# EAGLE design pc_kalam_v3 (EAGLE 6.4)
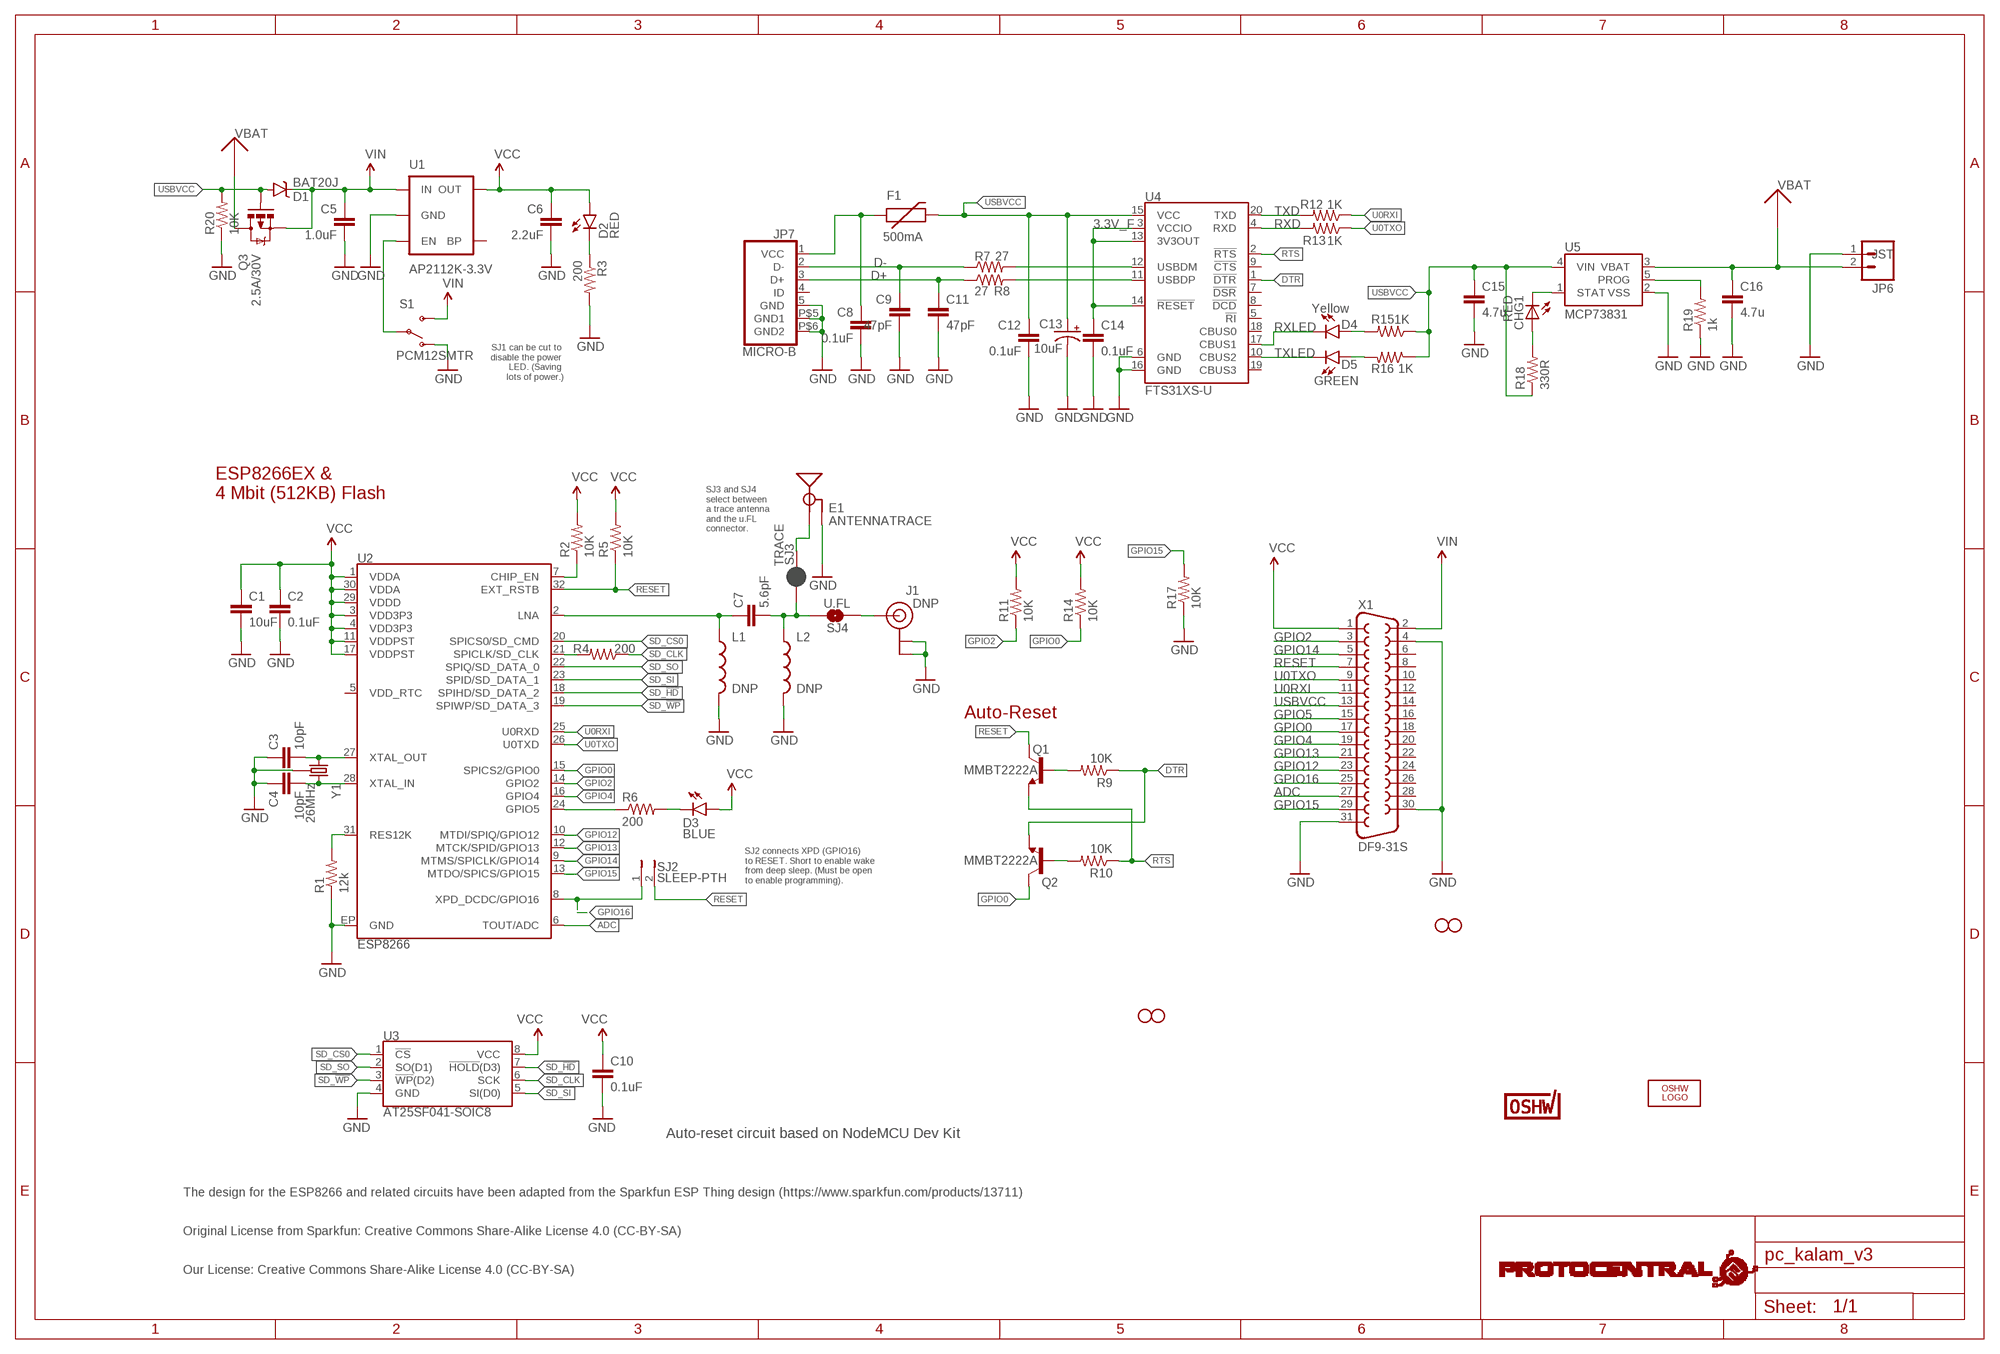
[diagram p0: schematic, sheet 1]

## Parts
C1  10uF  10UF-6.3V-20%(0603)  [0603-CAP]
C2  0.1uF  0.1UF-25V(+80/-20%)(0603)  [0603-CAP]
C3  10pF  10PF-50V-5%(0603)  [0603-CAP]
C4  10pF  10PF-50V-5%(0603)  [0603-CAP]
C5  1.0uF  1.0UF-25V-+80/-20(0805)  [0805]
C6  2.2uF  2.2UF-10V-20%(0603)  [0603-CAP]
C7  5.6pF  CAP0603-CAP  [0603-CAP]
C8  0.1uF  C-EUC0402  [C0402]
C9  47pF  47PF-50V-5%(0603)  [0603-CAP]
C10  0.1uF  0.1UF-25V(+80/-20%)(0603)  [0603-CAP]
C11  47pF  47PF-50V-5%(0603)  [0603-CAP]
C12  0.1uF  0.1UF-25V(+80/-20%)(0603)  [0603-CAP]
C13  10uF  10UF-16V-10%(TANT)  [EIA3216]
C14  0.1uF  0.1UF-25V(+80/-20%)(0603)  [0603-CAP]
C15  4.7u  C-EUC0805  [C0805]
C16  4.7u  C-EUC0805  [C0805]
CHG1  RED  LEDCHIPLED_0603  [CHIPLED_0603]
D1  BAT20J  DIODE-SCHOTTKY-BAT20J  [SOD-323]
D2  RED  LED-RED0603  [LED-0603]
D3  BLUE  LED-BLUE0603  [LED-0603]
D4  Yellow  LED-YELLOW0603  [LED-0603]
D5  GREEN  LED-GREEN0603  [LED-0603]
E1  ANTENNATRACE  [TRACE_ANTENNA_2.4GHZ_25.7MM]
F1  500mA  PTCSMD  [PTC-1206]
J1  DNP  U.FL  [U.FL]
JP6  M02-JST-2MM-SMT  [JST-2-SMD]
JP7  MICRO-B  [MICRO-B]
L1  DNP  INDUCTOR0603  [0603]
L2  DNP  INDUCTOR0603  [0603]
LOGO2  OSHW_LOGO_FILLX0200-NT  [OSHW_FILLX200_NOTEXT]
Q1  MMBT2222A  TRANSISTOR_NPNMMBT2222A  [SOT23-3@1]
Q2  MMBT2222A  TRANSISTOR_NPNMMBT2222A  [SOT23-3@1]
Q3  2.5A/30V  MOSFET-PCHANNELDMG2307L  [SOT23-3]
R1  12k  12KOHM-1/10W-1%(0603)  [0603-RES]
R2  10K  10KOHM1/10W1%(0603)0603  [0603-RES]
R3  200  200OHM1/10W1%(0603)  [0603-RES]
R4  200  200OHM1/10W1%(0603)  [0603-RES]
R5  10K  10KOHM1/10W1%(0603)0603  [0603-RES]
R6  200  200OHM1/10W1%(0603)  [0603-RES]
R7  27  27OHM1/10W1%(0603)0603-RES  [0603-RES]
R8  27  27OHM1/10W1%(0603)0603-RES  [0603-RES]
R9  10K  10KOHM1/10W1%(0603)0603  [0603-RES]
R10  10K  10KOHM1/10W1%(0603)0603  [0603-RES]
R11  10K  10KOHM1/10W1%(0603)0603  [0603-RES]
R12  1K  1KOHM-1/10W-1%(0603)  [0603-RES]
R13  1K  1KOHM-1/10W-1%(0603)  [0603-RES]
R14  10K  10KOHM1/10W1%(0603)0603  [0603-RES]
R15  1K  1KOHM-1/10W-1%(0603)  [0603-RES]
R16  1K  1KOHM-1/10W-1%(0603)  [0603-RES]
R17  10K  10KOHM1/10W1%(0603)0603  [0603-RES]
R18  330R  R-US_R0402  [R0402]
R19  1k  R-US_R0402  [R0402]
R20  10K  R-US_R0402  [R0402]
S1  PCM12SMTR  SWITCH-SPDT-SMD-A  [SWITCH-SPST-SMD-A]
SJ2  SLEEP-PTH  JUMPER-PTH-2-NO  [PTH-JUMPER-2-NO_NO_SILK]
SJ3  TRACE  JUMPER-PAD-2-NC_BY_PASTENO-SILK  [PAD-JUMPER-2-NC_BY_PASTE_NO_SILK]
SJ4  U.FL  JUMPER-PAD-2-NO  [PAD-JUMPER-2-NO_NO_SILK]
STANDOFF1  STAND-OFF  [STAND-OFF]
STANDOFF2  STAND-OFF  [STAND-OFF]
STANDOFF3  STAND-OFF  [STAND-OFF]
STANDOFF4  STAND-OFF  [STAND-OFF]
U1  AP2112K-3.3V  V_REG_LDOSMD  [SOT23-5]
U2  ESP8266  [QFN32]
U3  AT25SF041-SOIC8  [SO08]
U4  FTS31XS-U  FT231XS  [SSOP20_L]
U5  MCP73831  [SOT23-5]
U$1  PROTY_LOGO_WITH_TEXT  [PROTY_WITH_TEXT]
U$5  CERT-MEDIUM  [CERT-MED-SILK]
U$8  PROTY-LOGO  [LOGO-PROTY]
X1  DF9-31S  [DF9-31S]
Y1  26MHz  CRYSTAL-GROUNDED3.2X2.5  [CRYSTAL-SMD-3.2X2.5]

## Nets
3.3V_F: C14.1 U4.3(VCCIO) U4.13(3V3OUT) U4.14(!RESET)
ADC: U2.6(TOUT/ADC) X1.27
ANT: J1.P$3(SIGNAL) SJ4.1
CHIP_EN: R2.1 U2.7(CHIP_EN)
D+: C11.1 JP7.3(D+) R8.1
D-: C9.1 JP7.2(D-) R7.1
DTR: Q2.2(E) R9.1 U4.1(!DTR)
GND: C1.2 C2.2 C3.1 C4.1 C5.2 C6.2 C8.2 C9.2 C10.2 C11.2 C12.2 C13.C(-) C14.2 C15.2 C16.2 E1.GND E1.GND2(GND) J1.P$1(GND) J1.P$2(GND) JP6.1 JP7.5(GND) JP7.P$5(GND1) JP7.P$6(GND2) L1.2 L2.2 R1.1 R3.2 R17.1 R19.1 R20.1 S1.1(O) U1.2(GND) U2.EP(GND) U3.4(GND) U4.6(GND) U4.16(GND) U5.2(VSS) X1.4 X1.30 X1.31 Y1.2(GND) Y1.4(GND)
GPIO0: Q2.3(C) R14.1 U2.15(SPICS2/GPIO0) X1.17
GPIO2: R11.1 U2.14(GPIO2) X1.3
GPIO4: U2.16(GPIO4) X1.19
GPIO5: R6.1 U2.24(GPIO5) X1.15
GPIO12: U2.10(MTDI/SPIQ/GPIO12) X1.23
GPIO13: U2.12(MTCK/SPID/GPIO13) X1.21
GPIO14: U2.9(MTMS/SPICLK/GPIO14) X1.5
GPIO15: R17.2 U2.13(MTDO/SPICS/GPIO15) X1.29
GPIO16: SJ2.1 U2.8(XPD_DCDC/GPIO16) X1.25
LNA: C7.1 L1.1 U2.2(LNA)
LNA2: C7.2 L2.1 SJ3.1 SJ4.2
N$1: R1.2 U2.31(RES12K)
N$2: C4.2 U2.28(XTAL_IN) Y1.3
N$3: C3.2 U2.27(XTAL_OUT) Y1.1
N$4: R7.2 U4.12(USBDM)
N$6: Q1.1(B) R9.2
N$7: R8.2 U4.11(USBDP)
N$8: D5.A R16.2
N$9: D3.C R6.2
N$10: D4.A R15.2
N$11: D2.C R3.1
N$12: Q2.1(B) R10.2
N$13: CHG1.C U5.1(STAT)
N$14: S1.2(P) U1.3(EN)
N$15: CHG1.A R18.2
N$19: R19.2 U5.5(PROG)
RESET: Q1.3(C) R5.1 SJ2.2 U2.32(EXT_RSTB) X1.7
RTS: Q1.2(E) R10.1 U4.2(!RTS)
RXD: R13.2 U4.4(RXD)
RXLED: D4.C U4.17(CBUS1)
SD_!HD!: U2.18(SPIHD/SD_DATA_2) U3.7(!HOLD!(D3))
SD_!WP!: U2.19(SPIWP/SD_DATA_3) U3.3(!WP!(D2))
SD_CLK: R4.1 U3.6(SCK)
SD_CLK0: R4.2 U2.21(SPICLK/SD_CLK)
SD_CS0: U2.20(SPICS0/SD_CMD) U3.1(!CS!)
SD_SI: U2.23(SPID/SD_DATA_1) U3.5(SI(D0))
SD_SO: U2.22(SPIQ/SD_DATA_0) U3.2(SO(D1))
TRACE_ANT: E1.ANT(SIGNAL) SJ3.2
TXD: R12.2 U4.20(TXD)
TXLED: D5.C U4.10(CBUS2)
U0RXI: R12.1 U2.25(U0RXD) X1.11
U0TXO: R13.1 U2.26(U0TXD) X1.9
USBVCC: C12.1 C13.A(+) C15.1 D1.A F1.2 Q3.1(G) R15.1 R16.1 R18.1 R20.2 U4.15(VCC) U5.4(VIN) X1.13
VBAT: C16.1 JP6.2 Q3.3(D) U5.3(VBAT)
VCC: C1.1 C2.1 C6.1 C10.1 D2.A D3.A R2.2 R5.2 R11.2 R14.2 U1.5(OUT) U2.1(VDDA) U2.3(VDD3P3) U2.4(VDD3P3) U2.11(VDDPST) U2.17(VDDPST) U2.29(VDDD) U2.30(VDDA) U3.8(VCC) X1.1
VIN: C5.1 D1.C Q3.2(S) S1.3(S) U1.1(IN) X1.2
VUSB: C8.1 F1.1 JP7.1(VCC)
Unconnected: JP7.4(ID) U1.4(BP) U2.5(VDD_RTC) U4.5(!RI) U4.7(!DSR) U4.8(!DCD) U4.9(!CTS) U4.18(CBUS0) U4.19(CBUS3) X1.6 X1.8 X1.10 X1.12 X1.14 X1.16 X1.18 X1.20 X1.22 X1.24 X1.26 X1.28

## Notes on the sheet
- JST
- SJ1 can be cut to 
  disable the power 
  LED. (Saving 
  lots of power.)
- SJ3 and SJ4
  select between
  a trace antenna
  and the u.FL 
  connector.
- ESP8266EX &
  4 Mbit (512KB) Flash
- DNP
- Auto-Reset
- SJ2 connects XPD (GPIO16) 
  to RESET. Short to enable wake 
  from deep sleep. (Must be open
  to enable programming).
- Auto-reset circuit based on NodeMCU Dev Kit
- The design for the ESP8266 and related circuits have been adapted from the Sparkfun ESP Thing design (https://www.sparkfun.com/products/13711)
- Original License from Sparkfun: Creative Commons Share-Alike License 4.0 (CC-BY-SA)
- Our License: Creative Commons Share-Alike License 4.0 (CC-BY-SA)

## Library data of the parts
C1 = SparkFun-Capacitors:10UF-6.3V-20%(0603): CAP-11015; PROD_ID: CAP-11015
C2 C10 C12 C14 = SparkFun-Capacitors:0.1UF-25V(+80/-20%)(0603): CAP-00810 Ceramic Standard decoupling cap; PROD_ID: CAP-00810
C3 C4 = SparkFun-Capacitors:10PF-50V-5%(0603): CAP-11812; PROD_ID: CAP-11812
C5 = SparkFun-Capacitors:1.0UF-25V-+80/-20(0805): CAP-11625; PROD_ID: CAP-11625
C6 = SparkFun-Capacitors:2.2UF-10V-20%(0603): CAP-07888; PROD_ID: CAP-07888
C7 = SparkFun-Capacitors:CAP: Capacitor Standard 0603 ceramic capacitor, and 0.1" leaded capacitor.; PROD_ID: CAP-12456
C8 C15 C16 = rcl:C-EU: CAPACITOR, European symbol
C9 C11 = SparkFun-Capacitors:47PF-50V-5%(0603): CAP-08913; PROD_ID: CAP-08913
C13 = SparkFun-Capacitors:10UF-16V-10%(TANT): CAP-00811 1206/EIA-3216 Tantalum capacitor; PROD_ID: CAP-00811
CHG1 = led:LED: LED OSRAM: - CHIPLED LG R971, LG N971, LY N971, LG Q971, LY Q971, LO R971, LY R971 LH N974, LH R974 LS Q976, LO Q976, LY Q976 LO Q996 - Hyper CHIPLED LW Q18S LB Q993, LB Q99A, LB R99A - SideLED LS A670, LO A670, LY A670, LG A670, LP A670 LB A673, LV A673, LT A673, LW A673 LH A674 LY A675 LS A676, LA A676, LO A676, LY A676, LW A676 LS A679, LY A679, LG A679 - Hyper Micro SIDELED® LS Y876, LA Y876, LO Y876, LY Y876 LT Y87S - SmartLED LW L88C, LW L88S LB L89C, LB L89S, LG L890 LS L89K, LO L89K, LY L89K LS L896, LA L896, LO L896, LY L896 - TOPLED LS T670, LO T670, LY T670, LG T670, LP T670 LSG T670, LSP T670, LSY T670, LOP T670, LYG T670 LG T671, LOG T671, LSG T671 LB T673, LV T673, LT T673, LW T673 LH T674 LS T676, LA T676, LO T676, LY T676, LB T676, LH T676, LSB T676, LW T676 LB T67C, LV T67C, LT T67C, LS T67K, LO T67K, LY T67K, LW E67C LS E67B, LA E67B, LO E67B, LY E67B, LB E67C, LV E67C, LT E67C LW T67C LS T679, LY T679, LG T679 LS T770, LO T770, LY T770, LG T770, LP T770 LB T773, LV T773, LT T773, LW T773 LH T774 LS E675, LA E675, LY E675, LS T675 LS T776, LA T776, LO T776, LY T776, LB T776 LHGB T686 LT T68C, LB T68C - Hyper Mini TOPLED® LB M676 - Mini TOPLED Santana® LG M470 LS M47K, LO M47K, LY M47K Source: http://www.osram.convergy.de LUXEON: - LUMILED® LXK2-PW12-R00, LXK2-PW12-S00, LXK2-PW14-U00, LXK2-PW14-V00 LXK2-PM12-R00, LXK2-PM12-S00, LXK2-PM14-U00 LXK2-PE12-Q00, LXK2-PE12-R00, LXK2-PE12-S00, LXK2-PE14-T00, LXK2-PE14-U00 LXK2-PB12-K00, LXK2-PB12-L00, LXK2-PB12-M00, LXK2-PB14-N00, LXK2-PB14-P00, LXK2-PB14-Q00 LXK2-PR12-L00, LXK2-PR12-M00, LXK2-PR14-Q00, LXK2-PR14-R00 LXK2-PD12-Q00, LXK2-PD12-R00, LXK2-PD12-S00 LXK2-PH12-R00, LXK2-PH12-S00 LXK2-PL12-P00, LXK2-PL12-Q00, LXK2-PL12-R00 Source: www.luxeon.com KINGBRIGHT: KA-3528ASYC Source: www.kingbright.com
D1 = SparkFun-DiscreteSemi:DIODE-SCHOTTKY: Schottky diodes in SFE's production catalog BAT20J 1A 23V 0.62Vf RB751 120mA 40V 0.37Vf PMEG4005EJ 0.5A 40V 0.42Vf MBRA140 1A 40V 0.5Vf B340A 3A 40V SMA; PROD_ID: DIO-11623
D2 = SparkFun-LED:LED-RED: Assorted Red LEDs LilyPad 1206- DIO-09912 1206- DIO-00809 0603- DIO-00819 "SMART" means more efficient and expensive; PROD_ID: DIO-00819
D3 = SparkFun-LED:LED-BLUE: Blue LEDs for production use Various blue LEDs stocked by SparkFun production 0603 - DIO-08575 Rebel - DIO-09553 1206 - DIO-09911; PROD_ID: DIO-08575
D4 = SparkFun-LED:LED-YELLOW: Yellow SMD LEDs LilyPad 1206- DIO-09909 0603- DIO-09003 "SMART" means more efficient and expensive; PROD_ID: DIO-09003
D5 = SparkFun-LED:LED-GREEN: Various green LEDs Green LEDs used in SFE Production 0603- DIO-00821 LARGE- DIO-00862 LILYPAD- DIO-09910; PROD_ID: DIO-00821
E1 = SparkFun-RF:ANTENNA: Chip antenna Chip antenna with ground or secondary connection. Common with larger metal RF connectors.
F1 = SparkFun-PowerIC:PTC: Resettable Fuse PTC Resettable Fuse. Spark Fun Electronics SKU : COM-08357; PROD_ID: RES-11150
J1 = SparkFun-Connectors:U.FL: SMD antenna connector- WRL-09144; PROD_ID: CONN-09193; VALUE: U.FL
JP6 = SparkFun:M02: Header 2 Standard 2-pin 0.1" header. Use with straight break away headers (SKU : PRT-00116), right angle break away headers (PRT-00553), swiss pins (PRT-00743), machine pins (PRT-00117), and female headers (PRT-00115). Molex polarized connector foot print use with SKU : PRT-08233 with associated crimp pins and housings.
JP7 = circuitects:MICRO-B
L1 L2 = SparkFun-Passives:INDUCTOR: Inductors Basic Inductor/Choke - 0603 and 1206. Footprints are not proven and vary greatly between part numbers. INDUCTOR POWER 3.3UH 4.0A SMD 0.197" L x 0.197" W x 0.177" H (5.00mm x 5.00mm x 4.50mm)
LOGO2 = ohw-logo:OSHW_LOGO_FILL
Q1 Q2 = SparkFun-DiscreteSemi:TRANSISTOR_NPN: Generic NPN BJT MMBT2222A - TRANS-08049 (SOT-23, 1A 40V) MPSA42 - TRANS-09116 (SOT-23, 500mA 300V) MMBT5088LT1G - TRANS-11160 (SOT-23, 50 mA 30V) BC547 - COM-08928 <http://www.sparkfun.com/products/8928> (TO-92 45V 100mA) (1.Collector 2.Base 3.Emitter) 2N3904 - COM-00521 <http://www.sparkfun.com/products/521> (TO-92 40V 200mA) (1.Emitter 2.Base 3.Collector) P2N2222A - COM-12852 <http://www.sparkfun.com/products/12852> (TO-92 40V 600mA) (1.Collector 2.Base 3.Emitter); PROD_ID: TRANS-08049
Q3 = SparkFun-DiscreteSemi:MOSFET-PCHANNEL: Generic PMOSFET IRLML2244 - TRANS-11153 (SOT-23 -20V -4.3A) (1.Gate 2.Source 3.Drain) FQP27P06 - COM-10349 <http://www.sparkfun.com/products/10349> (TO-220 -60V -27A) (1.Gate 2.Source 3.Drain); PROD_ID: TRANS-11308
R1 = SparkFun-Resistors:12KOHM-1/10W-1%(0603): RES-10327; PROD_ID: RES-10327
R2 R5 R9-R11 R14 R17 = SparkFun-Resistors:10KOHM1/10W1%(0603): RES-00824; PROD_ID: RES-00824
R3 R4 R6 = SparkFun-Resistors:200OHM1/10W1%(0603): RES-08220; PROD_ID: RES-08220
R7 R8 = SparkFun-Resistors:27OHM1/10W1%(0603): RES-09334; PROD_ID: RES-09334
R12 R13 R15 R16 = SparkFun-Resistors:1KOHM-1/10W-1%(0603): RES-07856; PROD_ID: RES-07856
R18-R20 = rcl:R-US_: RESISTOR, American symbol
S1 = SparkFun-Electromechanical:SWITCH-SPDT: SPDT Switch Simple slide switch, Spark Fun Electronics SKU : COM-00102 DPDT SMT slide switch, AYZ0202, SWCH-08179; PROD_ID: SWCH-10651
SJ2 = SparkFun-Passives:JUMPER-PTH-2-NO
SJ3 = SparkFun-Passives:JUMPER-PAD-2-NC_BY_PASTE
SJ4 = SparkFun-Passives:JUMPER-PAD-2-NO
STANDOFF1-STANDOFF4 = SparkFun-Electromechanical:STAND-OFF: #4 Stand Off This is the mechanical footprint for a #4 phillips button head screw. Use the keepout ring to avoid running the screw head into surrounding components. SKU : PRT-00447
U1 = SparkFun-PowerIC:V_REG_LDO: Voltage Regulator LDO Standard 150mA LDO voltage regulator in SOT-23 layout. Micrel part MIC5205. BP (by-pass) pin is used to lower output noise with 470pF cap.; PROD_ID: VREG-12457
U2 = esp8266-development-board:ESP8266: Espressif ESP8266 WiFi Smart Connectivity Platform.; PROD_ID: IC-12452
U3 = esp8266-development-board:AT25SF041: SPI Serial Flash Memory with Dual/Quad-IO Support Example: Adesto Technologies AT25SF041-SSHD-T (1265-1131-1-ND) <http://www.digikey.com/product-detail/en/AT25SF041-SSHD-T/1265-1131-1-ND/4824165>; PROD_ID: IC-12455
U4 = SparkFun-DigitalIC:FT231X: FTDI FT231X Full Speed USB to Full-handshake UART This USB2.0 Full Speed IC offers a compact bridge to full handshake UART interfaces. The device is a UART, capable of operating up to 3MBaud, with low power consumption (8mA). The FT231X includes the complete FT-X series feature set and enables USB to be added into a system design quickly and easily over a UART interface.; PROD_ID: IC-11524
U5 = SparkFun:MCP73831: Microchip's MCP73831 Miniature single cell, fully integrated Li-Ion, Li-polymer charge management controller http://ww1.microchip.com/downloads/en/DeviceDoc/21984a.pdf
U$1 = circuitects:PROTY_LOGO_WITH_TEXT
U$5 = OSHWA:CERT
U$8 = circuitects:PROTY-LOGO
X1 = con-hirose:DF9-31S: SMD CONNECTOR Source: con-hirose.lbr from Bob Starr <rtzaudio@mindspring.com>; MPN: DF9-31S-1V(32); OC_FARNELL: 1798382; OC_NEWARK: 74R3383
Y1 = things:CRYSTAL-GROUNDED; PROD_ID: XTAL-12454

## Net classes
2 gnd: width 0.102 mm, drill 0.1 mm

## Board
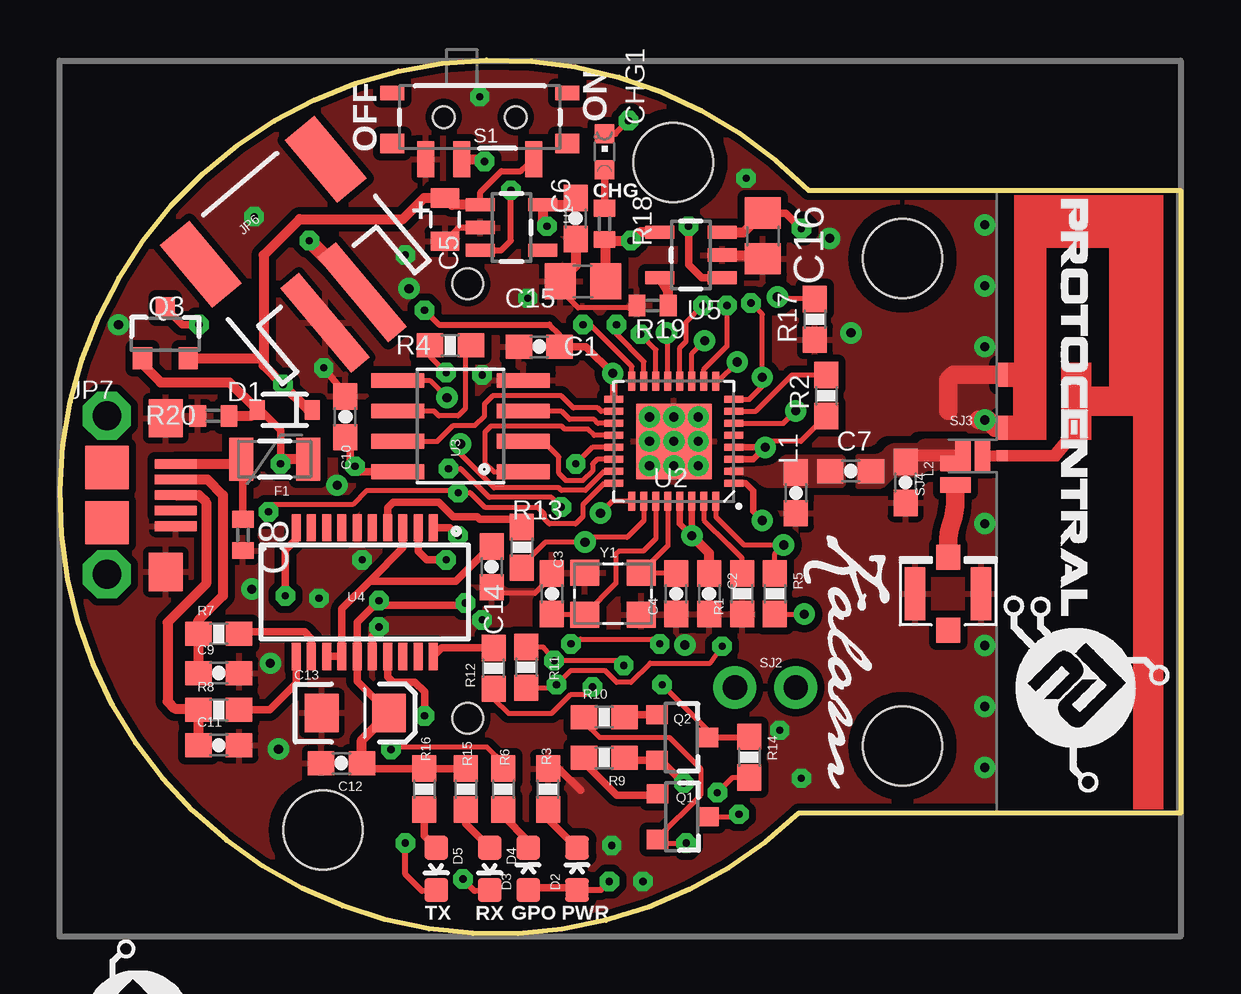
[diagram p1: board, top side]
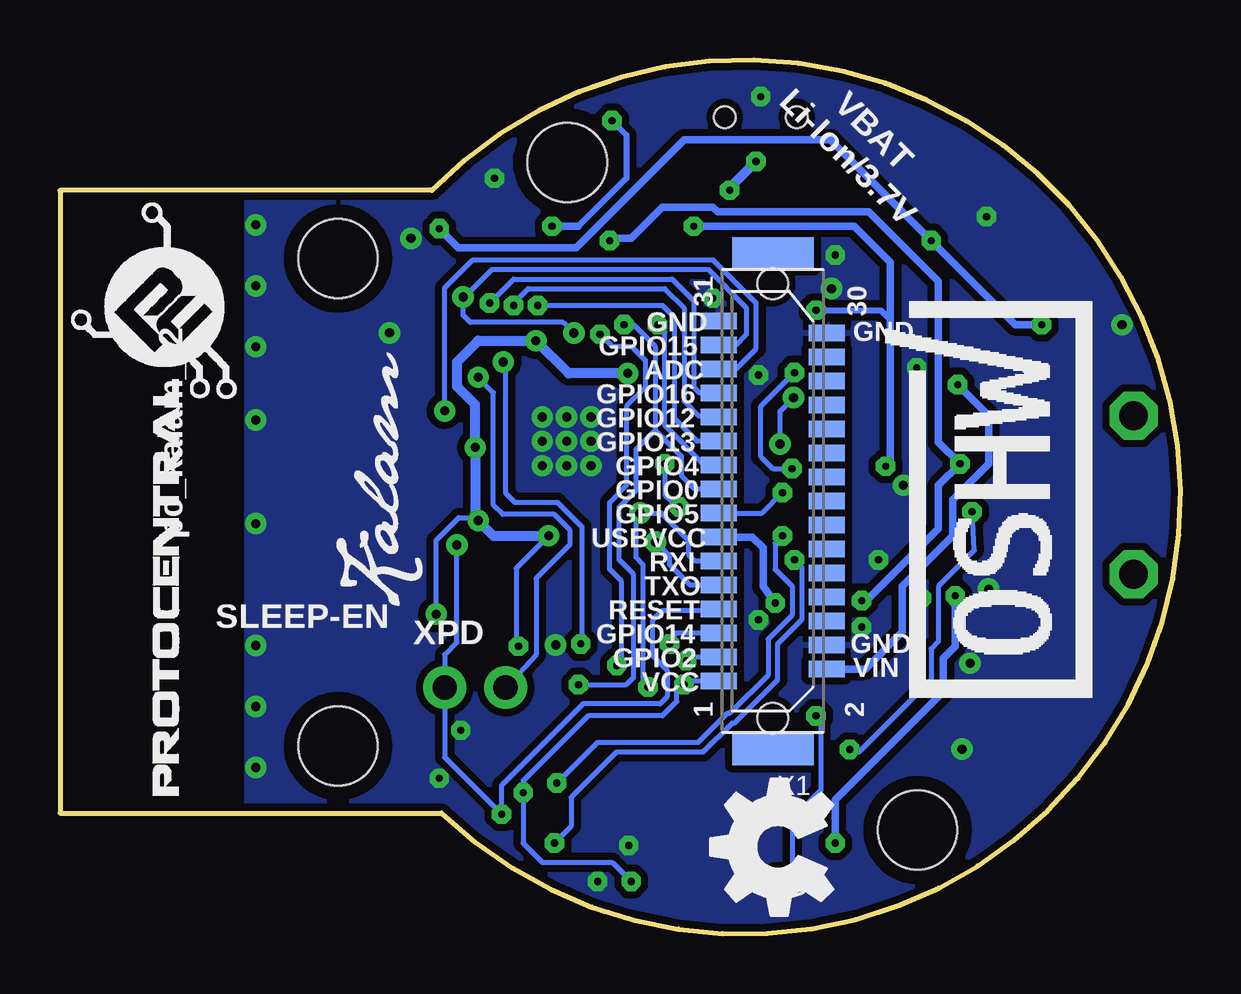
[diagram p2: board, bottom side, seen from below]

Size 46.69 x 36.4 mm. Coordinates in mm from the lower left corner, seen from the top.
Outline: 31.19,30.97 46.69,30.97 46.69,5.02 30.79,5.02 arc-269 31.19,30.97
Copper layers (1*2*15*16): Top 0.035mm / dielectric 1.5mm / Route2 0.035mm / dielectric 0.15mm / Route15 0.035mm / dielectric 0.2mm / Bottom 0.035mm
Design rules "Circuitects-Rules": minimum track width 6mil, minimum drill 0.3mm, track to track 6mil, track to pad 6mil, pad to pad 6mil, via to via 6mil, smd to smd 6mil, copper to edge 10mil, drill to drill 8mil, minimum pad ring 12mil, minimum via ring 10mil, stop-mask expansion 4mil, vias tented up to drill 25mil, thermal gap 10mil

### Footprints (pad centres in the part's own frame; a part is rotated, then mirrored left to right if it is on the bottom)
0603-CAP = smd 1.1 x 1: 1 -0.85,0; 2 0.85,0
0805 = smd 0.8 x 1.2: 1 -0.9,0; 2 0.9,0
C0402 = smd 0.7 x 0.9: 1 -0.65,0; 2 0.65,0
EIA3216 = smd 1.4 x 1.6: A 1.4,0; C -1.4,0
C0805 = smd 1.3 x 1.5: 1 -0.95,0; 2 0.95,0
CHIPLED_0603 = smd 0.8 x 0.8: A 0,-0.75; C 0,0.75
SOD-323 = smd 0.63 x 0.83: A 1.15,0; C -1.15,0
LED-0603 = smd 1 x 1: A 0,-0.877; C 0,0.877
TRACE_ANTENNA_2.4GHZ_25.7MM = smd 0.46 x 0.46: ANT 0,0.23 | smd 1 x 0.46: GND -1.18,0.23; GND2 -3.38,0.23
PTC-1206 = smd 1 x 1.8: 1 -1.4,0; 2 1.4,0
U.FL = smd 2.2 x 0.85: P$1 0,1.375; P$2 0,-1.375 | smd 1.05 x 1: P$3 1.525,0; P$4 -1.525,0
JST-2-SMD = smd 1 x 4.6: 1 -1,-3.7; 2 1,-3.7 | smd 1.6 x 3.4: NC1 -3.4,1.5; NC2 3.4,1.5
MICRO-B = smd 0.4 x 1.75: 1 -1.25,2.975; 2 -0.6,2.975; 3 0.05,2.975; 4 0.7,2.975; 5 1.35,2.975 | smd 1.8 x 1.8: P$1 -1.1,0.1; P$2 1.2,0.1 | drill 1.2 pad 2 octagon: P$3 -3.25,0.1; P$4 3.35,0.1 | smd 1.6 x 1.4: P$5 -3.15,2.55; P$6 3.25,2.55
0603 = smd 1.1 x 1: 1 -0.85,0; 2 0.85,0
SOT23-3@1 = smd 0.8 x 0.9: 1 -0.95,-1; 2 0.95,-1; 3 0,1.1
SOT23-3 = smd 0.8 x 0.9: 1 -0.95,-1; 2 0.95,-1; 3 0,1.1
0603-RES = smd 1.1 x 1: 1 -0.85,0; 2 0.85,0
R0402 = smd 0.7 x 0.9: 1 -0.65,0; 2 0.65,0
SWITCH-SPST-SMD-A = smd 0.7 x 1.5: 1 -2.25,-1.75; 2 -0.75,-1.75; 3 2.25,-1.75 | smd 1 x 0.6: GND1 -3.65,1; GND3 3.65,1 | smd 1 x 0.8: GND2 -3.65,-1.1; GND4 3.65,-1.1 | hole 0.9: -1.5,0; 1.5,0
PTH-JUMPER-2-NO_NO_SILK = drill 1.016 pad 1.778: 1 -1.27,0; 2 1.27,0
PAD-JUMPER-2-NC_BY_PASTE_NO_SILK = smd 0.635 x 1.27: 1 -0.401,0; 2 0.413,0
PAD-JUMPER-2-NO_NO_SILK = smd 0.635 x 1.27: 1 -0.45,0; 2 0.45,0
STAND-OFF = hole 3.302: 0,0
SOT23-5 = smd 0.55 x 1.2: 1 -0.95,-1.3; 2 0,-1.3; 3 0.95,-1.3; 4 0.95,1.3; 5 -0.95,1.3
QFN32 = smd 0.8 x 0.285: 1 -2.5,1.75; 2 -2.5,1.25; 3 -2.5,0.75; 4 -2.5,0.25; 5 -2.5,-0.25; 6 -2.5,-0.75; 7 -2.5,-1.25; 8 -2.5,-1.75; 17 2.5,-1.75; 18 2.5,-1.25; 19 2.5,-0.75; 20 2.5,-0.25; 21 2.5,0.25; 22 2.5,0.75; 23 2.5,1.25; 24 2.5,1.75 | smd 0.285 x 0.8: 9 -1.75,-2.5; 10 -1.25,-2.5; 11 -0.75,-2.5; 12 -0.25,-2.5; 13 0.25,-2.5; 14 0.75,-2.5; 15 1.25,-2.5; 16 1.75,-2.5; 25 1.75,2.5; 26 1.25,2.5; 27 0.75,2.5; 28 0.25,2.5; 29 -0.25,2.5; 30 -0.75,2.5; 31 -1.25,2.5; 32 -1.75,2.5 | smd 3.15 x 3.15: EP 0,0
SO08 = smd 0.61 x 2.21: 1 -1.905,-2.616; 2 -0.635,-2.616; 3 0.635,-2.616; 4 1.905,-2.616; 5 1.905,2.616; 6 0.635,2.616; 7 -0.635,2.616; 8 -1.905,2.616
SSOP20_L = smd 0.381 x 1.143: 1 -2.857,-2.68; 2 -2.223,-2.68; 3 -1.587,-2.68; 4 -0.953,-2.68; 5 -0.318,-2.68; 6 0.318,-2.68; 7 0.953,-2.68; 8 1.587,-2.68; 9 2.223,-2.68; 10 2.857,-2.68; 11 2.857,2.68; 12 2.223,2.68; 13 1.587,2.68; 14 0.953,2.68; 15 0.318,2.68; 16 -0.318,2.68; 17 -0.953,2.68; 18 -1.587,2.68; 19 -2.223,2.68; 20 -2.857,2.68
DF9-31S = smd 0.7 x 1.5: 1 -7.5,2.25; 2 -7,-2.25; 3 -6.5,2.25; 4 -6,-2.25; 5 -5.5,2.25; 6 -5,-2.25; 7 -4.5,2.25; 8 -4,-2.25; 9 -3.5,2.25; 10 -3,-2.25; 11 -2.5,2.25; 12 -2,-2.25; 13 -1.5,2.25; 14 -1,-2.25; 15 -0.5,2.25; 16 0,-2.25; 17 0.5,2.25; 18 1,-2.25; 19 1.5,2.25; 20 2,-2.25; 21 2.5,2.25; 22 3,-2.25; 23 3.5,2.25; 24 4,-2.25; 25 4.5,2.25; 26 5,-2.25; 27 5.5,2.25; 28 6,-2.25; 29 6.5,2.25; 30 7,-2.25; 31 7.5,2.25 | smd 1.3 x 3.4: M1 -10.35,0; M2 10.35,0 | hole 1.27: 9.05,0; -9.05,0
CRYSTAL-SMD-3.2X2.5 = smd 1.2 x 1.1: 1 -1.175,-0.875; 2 1.175,-0.875; 3 1.175,0.875; 4 -1.175,0.875

### Placement (x,y rotation side)
C1  19.97,24.46 180 top
C2  27.05,14.16 270 top
C3  20.5,14.16 270 top
C4  25.68,14.16 90 top
C5  16.05,29.75 270 top
C6  21.48,29.8 270 top
C7  32.94,19.27 0 top
C8  7.62,16.61 270 top
C9  6.62,10.86 0 top
C10  11.89,21.53 90 top
C11  6.62,7.85 0 top
C12  11.73,7.1 180 top
C13  12.31,9.19 0 top
C14  17.98,15.28 270 top
C15  21.79,27.17 180 top
C16  29.29,29.07 270 top
CHG1  22.69,32.57 0 top
D1  9.36,21.82 180 top
D2  21.54,2.7 0 top
D3  19.51,2.7 0 top
D4  17.91,2.7 180 top
D5  15.68,2.7 180 top
E1  39.04,19.9 270 top
F1  8.94,19.77 0 top
J1  37.01,14.16 90 top
JP6  9.43,28.92 40 top
JP7  1.86,18.32 270 top
L1  30.66,18.37 270 top
L2  35.23,18.8 270 top
LOGO2  14.49,0.77 90 bottom
Q1  25.9,4.87 270 top
Q2  25.88,8.17 270 top
Q3  4.39,24.97 0 top
R1  28.42,14.16 90 top
R2  31.93,22.42 270 top
R3  20.34,6.02 90 top
R4  16.27,24.51 180 top
R5  29.79,14.16 270 top
R6  18.47,6.02 270 top
R7  6.62,12.49 0 top
R8  6.62,9.32 0 top
R9  22.68,7.33 180 top
R10  22.68,9.01 0 top
R11  19.43,11.09 270 top
R12  18.07,11.05 90 top
R13  19.25,16.09 90 top
R14  28.72,7.35 270 top
R15  16.91,6.02 270 top
R16  15.18,6.02 270 top
R17  31.46,25.59 90 top
R18  22.69,29.57 90 top
R19  24.69,26.17 0 top
R20  6.39,21.57 0 top
S1  17.49,34.02 0 top
SJ2  29.39,10.25 0 top
SJ3  38.02,19.9 0 top
SJ4  37.3,19.14 90 top
STANDOFF1  35.1,7.81 0 top
STANDOFF2  25.55,32.13 0 top
STANDOFF3  35.1,28.13 0 top
STANDOFF4  10.95,4.31 0 top
U1  18.81,29.42 270 top
U2  25.58,20.51 180 top
U3  16.69,21.15 90 top
U4  12.7,14.23 180 top
U5  26.29,28.27 90 top
U$1  39.69,5.76 90 bottom
U$2  PROTY_LOGO_WITH_TEXT  [PROTY_WITH_TEXT]  39.68,30.59 270 top
U$3  [KALAM-NAME-ONLY]  31.59,13.57 90 bottom
U$4  [KALAM-NAME-ONLY]  30.99,16.67 270 top
U$5  3.69,18.07 90 bottom
U$8  -0.31,-6.63 0 top  (outside the outline)
X1  16.99,18.02 90 bottom
Y1  23.04,14.16 0 top

### Tracks (layer width: path | path; a pad name or v marks a point on that pad's centre or on a via)
3.3V_F
  Top 0.305: U4.13 U4.14 11.75,13.53 12.94,14.72 | U4.3 14.28,16.07 12.94,14.72 | C14.1 17.75,16.03 17.75,15.93 16.49,14.67 12.99,14.67 12.94,14.72
ADC  (via drill 0.38)
  Top 0.203: U2.6 30.14,21.26 v30.66,21.78
  Bottom 0.2: X1.27 18.54,23.52 17.69,24.37 17.69,26.27 19.49,28.07 29.49,28.07 30.66,26.9 30.66,26.86
  Bottom 0.203: v30.66,21.78 30.66,26.86
ANT
  Top 0.508: 37.3,18.35 SJ4.1
  Top 0.762: J1.P$3 37.01,16.32 arc-19 37.13,17.08 arc23 37.3,18.35
CHIP_EN
  Top 0.203: U2.7 28.99,21.76 30.49,23.27 R2.1
D+
  Top 0.406: JP7.3 5.79,18.27 6.09,17.97 6.09,14.57 4.49,12.97 4.49,9.67 4.79,9.37 5.71,9.37 R8.1 C11.1
D-
  Top 0.406: JP7.2 6.14,18.92 6.79,18.27 6.79,14.07 5.77,13.05 R7.1 C9.1
DTR  (via drill 0.3)
  Top 0.305: U4.1 16.25,16.91 v16.59,16.57 | R9.1 23.64,7.22 Q2.2 25.04,7.22 v25.99,6.27
  Bottom 0.2: v16.59,16.57 16.89,16.27 16.89,15.17 16.19,14.47 16.19,13.27 17.19,12.27 17.19,10.77 18.79,9.17 18.89,9.17 20.09,7.97 24.29,7.97 v25.99,6.27
GND  (via drill 0.3, 0.38)
  Top 0.2: 20.5,14.98 20.5,14.88 19.79,14.17 18.24,14.17 C14.2 | R19.1 23.79,26.17 23.69,26.07 21.59,26.07 21.19,26.47 21.19,26.92 C15.2
  Top 0.254: U1.2 16.62,29.42 C5.2
  Top 0.305: U4.16 13.01,12.4 13.29,12.67 | C10.2 11.89,22.47 v10.99,23.57 | C3.1 20.5,14.98 | R3.2 20.79,6.87 21.69,5.97
  Top 0.406: U5.2 29.14,28.27 C16.2 | C6.2 21.48,27.82 C15.2
  Top 0.762: E1.GND2 37.24,23.28 37.01,23.05 37.01,21.78 | 38.28,21.4 38.66,21.4 38.98,21.08 E1.GND
  other vias: 25.58,20.51 25.58,21.53 25.58,19.5 24.56,20.51 24.56,21.53 24.56,19.5 26.59,21.53 26.59,20.51 26.59,19.5 9.11,7.69 26.04,12.02 32.07,28.97 11.55,18.68 14.54,26.88 32.96,25.03 8,14.35 8.77,11.27 2.44,25.37 38.53,17.08 38.53,12 38.53,9.46 38.53,6.92 38.53,21.4 38.53,24.45 38.53,26.99 38.53,29.53 8.09,29.87 14.39,28.27 28.59,31.47 30.89,6.47 24.29,2.17 19.49,26.47 17.59,13.07 13.29,12.77 10.79,13.97 29.99,8.47 22.99,3.67 17.59,23.27 12.59,15.57 17.49,34.87
  pour Bottom (isolate 0.305, rank 6): -0.01,0.02 0.19,33.03 -0.11,40.07 -0.11,40.37 39.99,40.37 39.99,30.93 38.91,30.93 38.91,5.02 39.99,5.02 39.99,-0.03
  pour Top (isolate 0.305, rank 6): -0.01,33.03 -0.01,-0.03 39.99,-0.03 39.99,4.97 30.49,4.97 arc-90 30.53,5.02 38.91,5.02 38.91,30.93 39.99,30.93 39.99,40.37 -0.21,40.37 -0.21,39.07
GPIO0  (via drill 0.3)
  Top 0.2: Q2.3 26.98,8.48 v25.09,10.37 | U2.15 24.33,23.83 23.19,24.97 v23.19,25.37
  Top 0.254: Q2.3 28.69,8.17 R14.1
  Bottom 0.2: X1.17 20.24,18.52 20.79,19.07 20.79,19.87 21.89,20.97 | v25.09,10.37 23.09,10.37 22.79,10.67 22.79,14.97 23.39,15.57 23.39,17.77 22.69,18.47 22.69,20.17 21.89,20.97 | v23.19,25.37 22.79,25.37 21.89,24.47 21.89,20.97
GPIO2  (via drill 0.3)
  Top 0.2: R11.1 20.12,11.94 v20.59,11.37 23.29,11.37 v23.49,11.17 | U2.14 24.83,24.33 v24.19,24.97
  Bottom 0.2: X1.3 20.54,11.52 v20.59,11.37 | v23.49,11.17 23.29,11.37 23.29,14.67 23.79,15.17 23.79,17.97 23.09,18.67 23.09,21.97 22.29,22.77 22.29,23.87 22.89,24.47 23.69,24.47 v24.19,24.97
GPIO4  (via drill 0.3)
  Top 0.2: U2.16 23.83,23.63 22.09,25.37 v21.79,25.37
  Bottom 0.2: X1.19 19.84,19.52 21.49,21.17 21.49,25.07 v21.79,25.37
GPIO5  (via drill 0.3)
  Top 0.2: v8.69,17.57 8.69,17.87 12.19,17.87 12.79,18.47 16.49,18.47 v16.59,18.37 17.09,18.37 17.69,17.77 19.89,17.77 20.19,17.47 20.19,17.27 20.39,17.07 21.49,17.07 21.79,17.37 21.79,17.87 22.68,18.76 U2.24 | R6.1 18.47,7.09 17.79,7.77 13.99,7.77 v13.79,7.67
  Bottom 0.2: v13.79,7.67 13.39,7.57 10.39,10.57 10.39,11.87 10.09,12.17 10.09,14.47 8.59,15.97 v8.69,17.57 | X1.15 17.44,17.52 v16.59,18.37
GPIO12  (via drill 0.3)
  Top 0.2: v27.79,26.17 27.79,24.47 26.83,23.51 U2.10
  Bottom 0.2: X1.23 19.29,21.57 20.09,21.57 20.69,22.17 20.69,26.07 21.49,26.87 27.19,26.87 27.79,26.27 v27.79,26.17
GPIO13  (via drill 0.3)
  Top 0.2: 26.79,25.87 v26.79,26.17 26.09,25.47 26.09,24.67 25.83,24.41 U2.12
  Bottom 0.2: X1.21 20.14,20.52 21.09,21.47 21.09,25.67 21.59,26.17 v26.79,26.17
GPIO14  (via drill 0.3, 0.38)
  Top 0.2: v21.29,12.07 21.69,12.27 24.69,12.27 v24.99,12.07 | U2.9 27.42,23.01 v28.22,23.81
  Bottom 0.2: X1.5 21.04,12.52 v21.29,12.07 | 24.94,16.96 24.94,12.43 v24.99,12.07 | 28.12,18.35 28.12,23.71 v28.22,23.81
  Bottom 0.203: 28.12,18.35 27.74,17.97 25.96,17.97 24.94,16.96
GPIO15  (via drill 0.38)
  Top 0.2: U2.13 25.33,24.97 v25.28,25.02 | R17.2 29.97,26.44 v29.89,26.52
  Bottom 0.2: X1.29 18.54,24.52 18.09,24.97 18.09,26.07 19.69,27.67 28.69,27.67 29.84,26.52 v29.89,26.52 | v25.28,25.02 25.73,25.47 29.59,25.47 29.89,25.77 v29.89,26.52 | v29.89,26.53 v29.89,26.52
GPIO16  (via drill 0.3, 0.38)
  Top 0.2: v29.26,23.18 29.26,25.8 v28.79,26.27
  Top 0.203: v29.26,23.18 29.26,22.8 28.72,22.26 U2.8
  Bottom 0.2: X1.25 20.04,22.52 20.29,22.77 20.29,26.37 21.19,27.27 27.79,27.27 v28.79,26.27
  Bottom 0.203: v29.26,23.18 28.63,22.54 28.63,17.85 28.24,17.46 26.09,17.46 25.45,16.83 25.45,16.19 26.85,14.8 26.85,11.62 SJ2.1
LNA
  pour Top (no thermals): 27.99,19.4 29.35,19.4 arc43 30.02,19.67 arc-43 30.34,19.88 32.47,19.88 arc-90 32.64,19.71 32.64,18.82 arc-90 32.53,18.66 29.62,18.66 arc-41 29.17,18.83 29.02,18.96 arc41 28.57,19.13 27.99,19.13
LNA2
  Top 0.508: SJ3.1 35.48,19.9 L2.1
  pour Top (isolate 0.305, no thermals): 33.25,18.63 34.14,18.63 arc43 34.48,18.89 34.64,19.04 arc-43 34.83,19.12 35.7,19.12 arc36 35.77,19.14 36.01,19.32 arc-36 36.25,19.4 37.46,19.4 37.46,20.51 36.08,20.51 arc25 35.91,20.48 35.8,20.36 arc-25 35.67,20.34 34.91,20.34 arc50 34.48,20.19 34.45,20.16 arc-50 33.98,19.88 33.25,19.88
N$1
  Top 0.2: R1.2 28.42,15.64 27.84,16.22
  Top 0.203: U2.31 26.83,17.23 27.84,16.22 28.12,15.94
N$2
  Top 0.203: U2.28 25.33,16.15 24.46,15.28 | 24.46,15.28 Y1.3 | C4.2 24.46,15.01 24.46,15.28
N$3
  Top 0.203: U2.27 24.83,16.46 24.31,15.94 23.29,15.94 23.16,15.81 23.16,14.59 Y1.1 21.84,13.31 C3.2
N$4
  Top 0.305: U4.12 10.48,12.28 10.19,12.57 7.55,12.57 R7.2
N$6
  Top 0.305: R9.2 21.83,7.13 23.19,5.77 24.85,5.77 Q1.1
N$7
  Top 0.305: U4.11 9.84,10.43 8.73,9.32 R8.2
N$8
  Top 0.305: R16.2 15.18,4.07 D5.A
N$9
  Top 0.305: R6.2 18.47,4.89 18.69,4.67 19.29,4.07 19.51,3.85 D3.C
N$10
  Top 0.305: R15.2 16.91,4.57 D4.A
N$11
  Top 0.305: R3.1 20.34,4.77 D2.C
N$12
  Top 0.305: Q2.1 23.64,9.12 R10.2
N$13  (via drill 0.3)
  Top 0.254: CHG1.C 23.14,33.32 v23.69,33.87
  Top 0.304: v26.19,29.47 26.19,27.87 26.74,27.32 U5.1
  Bottom 0.254: v23.69,33.87 23.09,33.27 23.09,31.47 25.09,29.47
  Bottom 0.304: 25.09,29.47 v26.19,29.47
N$14  (via drill 0.3)
  Top 0.254: U1.3 18.38,28.47 18.79,28.87 v18.79,30.97
  Top 0.406: S1.2 17.59,32.27 v17.69,32.17
  Bottom 0.406: v18.79,30.97 18.79,31.07 v17.69,32.17
N$15
  Top 0.305: CHG1.A R18.2
N$19
  Top 0.406: R19.2 25.34,26.77 U5.5
RESET  (via drill 0.3, 0.38)
  Top 0.2: Q1.3 28.19,4.87 v28.29,4.97 | R5.1 29.79,15.83 v30.15,16.19
  Top 0.203: U2.32 27.33,17.37 28.5,16.19 v30.15,16.19
  Bottom 0.2: X1.7 19.29,13.47 21.59,13.47 21.99,13.07 21.99,11.57 21.39,10.97 21.39,9.87 21.69,9.57 24.89,9.57 28.29,6.17 v28.29,4.97 30.66,7.34 SJ2.2
  Bottom 0.203: v30.15,16.19 30.15,12.13 30.66,11.62 SJ2.2
RTS  (via drill 0.3)
  Top 0.152: Q1.2 24.9,3.99
  Top 0.2: R10.1 21.83,8.83 22.49,8.17 25.39,8.17 26.69,6.87 26.69,5.77 24.9,3.99 | 24.9,3.76 26.07,3.76 v26.09,3.77
  Top 0.305: U4.2 14.92,15.94 15.29,15.57 v16.09,15.57 | Q1.2 24.9,3.76
  Bottom 0.2: v16.09,15.57 15.79,15.27 15.79,13.07 16.79,12.07 16.79,10.57 18.59,8.77 18.69,8.77 19.89,7.57 23.49,7.57 25.39,5.67 25.39,4.47 v26.09,3.77
RXD
  Top 0.305: U4.4 13.65,17.74 13.89,17.97 15.79,17.97 16.39,17.37 17.39,17.37 17.49,17.27 18.89,17.27 19.22,16.94 R13.2
RXLED  (via drill 0.3)
  Top 0.254: D4.C 17.29,1.77 v16.79,2.27
  Top 0.305: U4.17 13.65,10.71 13.89,10.47 14.79,10.47 15.19,10.07 v15.19,9.07
  Bottom 0.2: v15.19,9.07 15.19,8.87 14.99,8.67 14.99,5.97 16.19,4.77 16.19,2.87 v16.79,2.27
SD_!HD!
  Top 0.2: 14.93,20.51 15.73,20.51 16.39,21.17 17.29,21.17 17.69,21.57 17.69,22.07 18.03,22.42 20.88,22.42
  Top 0.203: U3.7 14.93,20.51 | U2.18 22.55,21.76 22.4,21.91 21.39,21.91 20.88,22.42
SD_!WP!
  Top 0.203: U2.19 22.41,21.26 22.25,21.43 21.23,21.43 20.88,21.78 U3.3
SD_CLK
  Top 0.2: U3.6 15.58,21.78 15.79,21.57 16.59,21.57 16.89,21.87 16.89,24.07 17.12,24.3 R4.1
SD_CLK0  (via drill 0.3)
  Top 0.2: U2.21 22.18,20.26 v21.49,19.57 | v20.89,17.77 20.49,18.17 17.89,18.17 16.69,19.37 v16.19,19.37 | R4.2 15.42,24.04 v16.09,23.37
  Top 0.254: R4.2 15.42,24.8
  Bottom 0.2: v21.49,19.57 21.49,18.27 v20.89,17.77 | v16.19,19.37 16.99,19.37 17.49,19.87 17.49,21.97 v16.09,23.37
SD_CS0
  Top 0.203: U2.20 22.25,20.76 22,21.02 21.03,21.02 20.9,21.15 17.96,21.15 17.7,20.89 17.7,19.62 18.08,19.24 U3.1
SD_SI  (via drill 0.38)
  Top 0.2: U2.23 22.68,19.26 21.89,18.47 20.89,18.47 20.79,18.57 18.09,18.57 16.69,19.97 v16.69,20.4 | U3.5 15.4,23.05 v16.12,22.33
  Bottom 0.2: v16.69,20.4 16.69,21.77 v16.12,22.33
SD_SO
  Top 0.2: 20.14,20.51 20.79,19.87 20.79,19.17 21.09,18.87 21.79,18.87 22.19,19.27 22.19,19.57 22.38,19.76 U2.22
  Top 0.203: 20.14,20.51 U3.2
TRACE_ANT
  Top 0.457: SJ3.2 E1.ANT
TXD
  Top 0.305: R12.2 15.9,11.9 U4.20
TXLED  (via drill 0.3)
  Top 0.254: D5.C 15.09,1.77 14.39,2.47 v14.39,3.77
  Top 0.305: U4.10 9.84,16.42 9.39,15.97 v9.39,14.07
  Bottom 0.305: v14.39,3.77 14.39,5.57 9.89,10.07 9.89,11.47 9.39,11.97 v9.39,14.07
U0RXI  (via drill 0.3, 0.38)
  Top 0.2: U2.25 23.01,18.01 v22.52,17.52 | R12.1 18.07,9.79 18.69,9.17 20.49,9.17 21.29,9.97 21.89,9.97 v22.19,10.27
  Bottom 0.2: X1.11 20.24,15.52 20.49,15.77 20.49,16.37 21.64,17.52 v22.52,17.52 | v22.52,17.52 22.54,17.52 | v22.19,10.27 22.39,10.47 22.39,15.37 22.69,15.67 22.69,17.35 v22.52,17.52
U0TXO  (via drill 0.38)
  Top 0.2: U2.26 24.33,17.21 23.63,16.51 22.08,16.51 v21.88,16.31 20.23,16.31 19.36,15.44 R13.1
  Bottom 0.2: X1.9 20.44,14.52 21.29,15.37 21.29,15.72 v21.88,16.31
USBVCC  (via drill 0.3)
  Top 0.305: R15.1 R16.1 12.81,6.87 C12.1 | C13.A 12.38,10.52 U4.15 12.38,12.96 v13.29,13.87 13.49,13.67 16.59,13.67 v16.89,13.77 | D1.A 8.34,21.82 9.19,20.97 v9.19,19.57
  Top 0.406: C12.1 12.58,8.06 C13.A | F1.2 9.38,19.77 v9.19,19.57 | C15.1 22.74,28.87 | 22.74,28.87 R18.1 | Q3.1 3.44,23.72 4.19,22.97 7.06,22.97 D1.A 7.97,21.57 R20.2 | U5.4 24.14,29.22 v23.79,28.87 22.74,28.87
  Bottom 0.304: v9.19,19.57 10.09,20.47 10.09,27.17 12.99,30.07 19.29,30.07 19.49,30.27 21.59,30.27 22.89,28.97
  Bottom 0.305: X1.13 17.84,16.52 17.39,16.07 17.39,14.47 v16.89,13.77 | v13.29,13.87 13.09,13.87 10.09,16.87 10.09,18.67 v9.19,19.57 | 22.89,28.97 23.69,28.97 v23.79,28.87
VBAT  (via drill 0.3)
  Top 0.305: C16.1 30.24,30.02 v30.89,29.37 | v5.79,25.37 5.09,25.37 Q3.3
  Top 0.406: U5.3 28.49,29.22 C16.1
  Top 0.61: JP6.2 12.53,26.73 v10.39,28.87
  Bottom 0.305: v30.89,29.37 30.09,28.57 25.19,28.57 20.69,33.07 14.59,33.07 v10.39,28.87 6.89,25.37 v5.79,25.37
VCC  (via drill 0.3, 0.38)
  Top 0.2: v27.59,11.97 27.09,11.27 24.59,11.27 23.79,10.47 23.19,10.47 22.69,10.97 21.29,10.97 v20.69,10.37 | R11.2 20.56,10.24 v20.69,10.37 | 20.79,10.47 v20.69,10.37 | R14.2 28.02,6.5 v27.39,5.87 | U2.11 26.33,24.17 v26.86,24.7
  Top 0.203: R2.2 30.87,20.51 29.64,20.51 v29.39,20.26 | R5.2 v31.01,13.31
  Top 0.254: 21.79,30.95 C6.1 | v15.19,25.97 15.79,25.37 20.39,25.37 20.82,24.94 C1.1 | D2.A 22.54,1.82 v22.89,2.17
  Top 0.279: U2.30 v26.33,16.58 25.83,17.08 U2.29 | U2.1 28.57,18.76 28.88,18.46 28.88,17.59 v29.26,17.21 | U2.4 v29.39,20.26 28.89,19.76 U2.3
  Top 0.304: 21.79,30.95 21.61,30.95
  Top 0.305: U2.17 23.08,23.29 v23.03,23.34 21.91,24.46 C1.1 | C10.1 12.09,20.48 12.09,19.67 v12.29,19.47 12.52,19.24 U3.8 | D2.A 21.44,1.92 19.61,1.92 D3.A
  Top 0.406: 26.55,16.58 v26.33,16.58 27.05,15.86 C2.1 | C6.1 21.2,30.37 U1.5 20.11,29.65 v20.29,29.47
  Bottom 0.2: v26.33,16.58 27.69,15.22 27.69,12.07 v27.59,11.97 | X1.1 20.54,10.52 v20.69,10.37 20.99,10.07 20.99,9.67 21.59,9.07 24.69,9.07 27.39,6.37 v27.39,5.87 27.39,3.77 26.59,2.97 23.69,2.97 v22.89,2.17 | v31.01,13.31 31.01,16.4 30.91,16.5
  Bottom 0.203: 30.91,16.5 30.07,17.34 29.39,17.34
  Bottom 0.254: v15.19,25.97 12.49,25.97 12.09,25.57
  Bottom 0.304: 12.09,27.97 13.59,29.47 v20.29,29.47
  Bottom 0.305: 12.09,27.97 12.09,25.57 12.09,19.67 v12.29,19.47
  Bottom 0.406: v26.33,16.58 28.63,16.58 v29.26,17.21 29.39,17.34 v29.39,20.26 29.39,22.04 30.15,22.8 30.15,23.81 29.26,24.7 v26.86,24.7 25.5,23.34 v23.03,23.34
VIN  (via drill 0.3)
  Top 0.254: U1.1 17.51,30.9 18.39,31.77 19.21,31.77 S1.3
  Top 0.406: 8.49,23.87 8.49,28.27 9.99,29.77 14.29,29.77 15.16,30.65 C5.1 16.33,30.37 U1.1 | 8.49,23.87 8.49,23.67 v9.29,22.87 10.34,21.82 D1.C | Q3.2 8.39,23.97 8.49,23.87
  Bottom 0.305: X1.2 13.14,11.02 11.59,12.57 11.59,14.47 9.49,16.57 9.49,18.07 7.99,19.57 7.99,21.57 v9.29,22.87 9.49,22.67
VUSB
  Top 0.305: C8.1 7.62,19.69 F1.1
  Top 0.406: JP7.1 7.35,19.57 F1.1

### Text on the board
tPlace: ON | OFF | CHG | + | TX | RX | GPO | PWR
bPlace: VBAT / Li-Ion/3.7V | GND | GND | GPIO15 | pc_kalam_r2 | ADC | GPIO16 | GPIO12 | GPIO13 | GPIO4 | GPIO0 | GPIO5 | USBVCC | RXI | TXO | RESET | GPIO14 | XPD | SLEEP-EN | GND | GPIO2 | VIN | VCC